# EasyEDA schematic SCH_mgts_main_board_2026-06-15.json
TITLE: Sheet_1; REV: 1.0; Date: 2026-05-31; Sheet: 1/1; Drawn By: u.s.pat1234; Company: Your Company
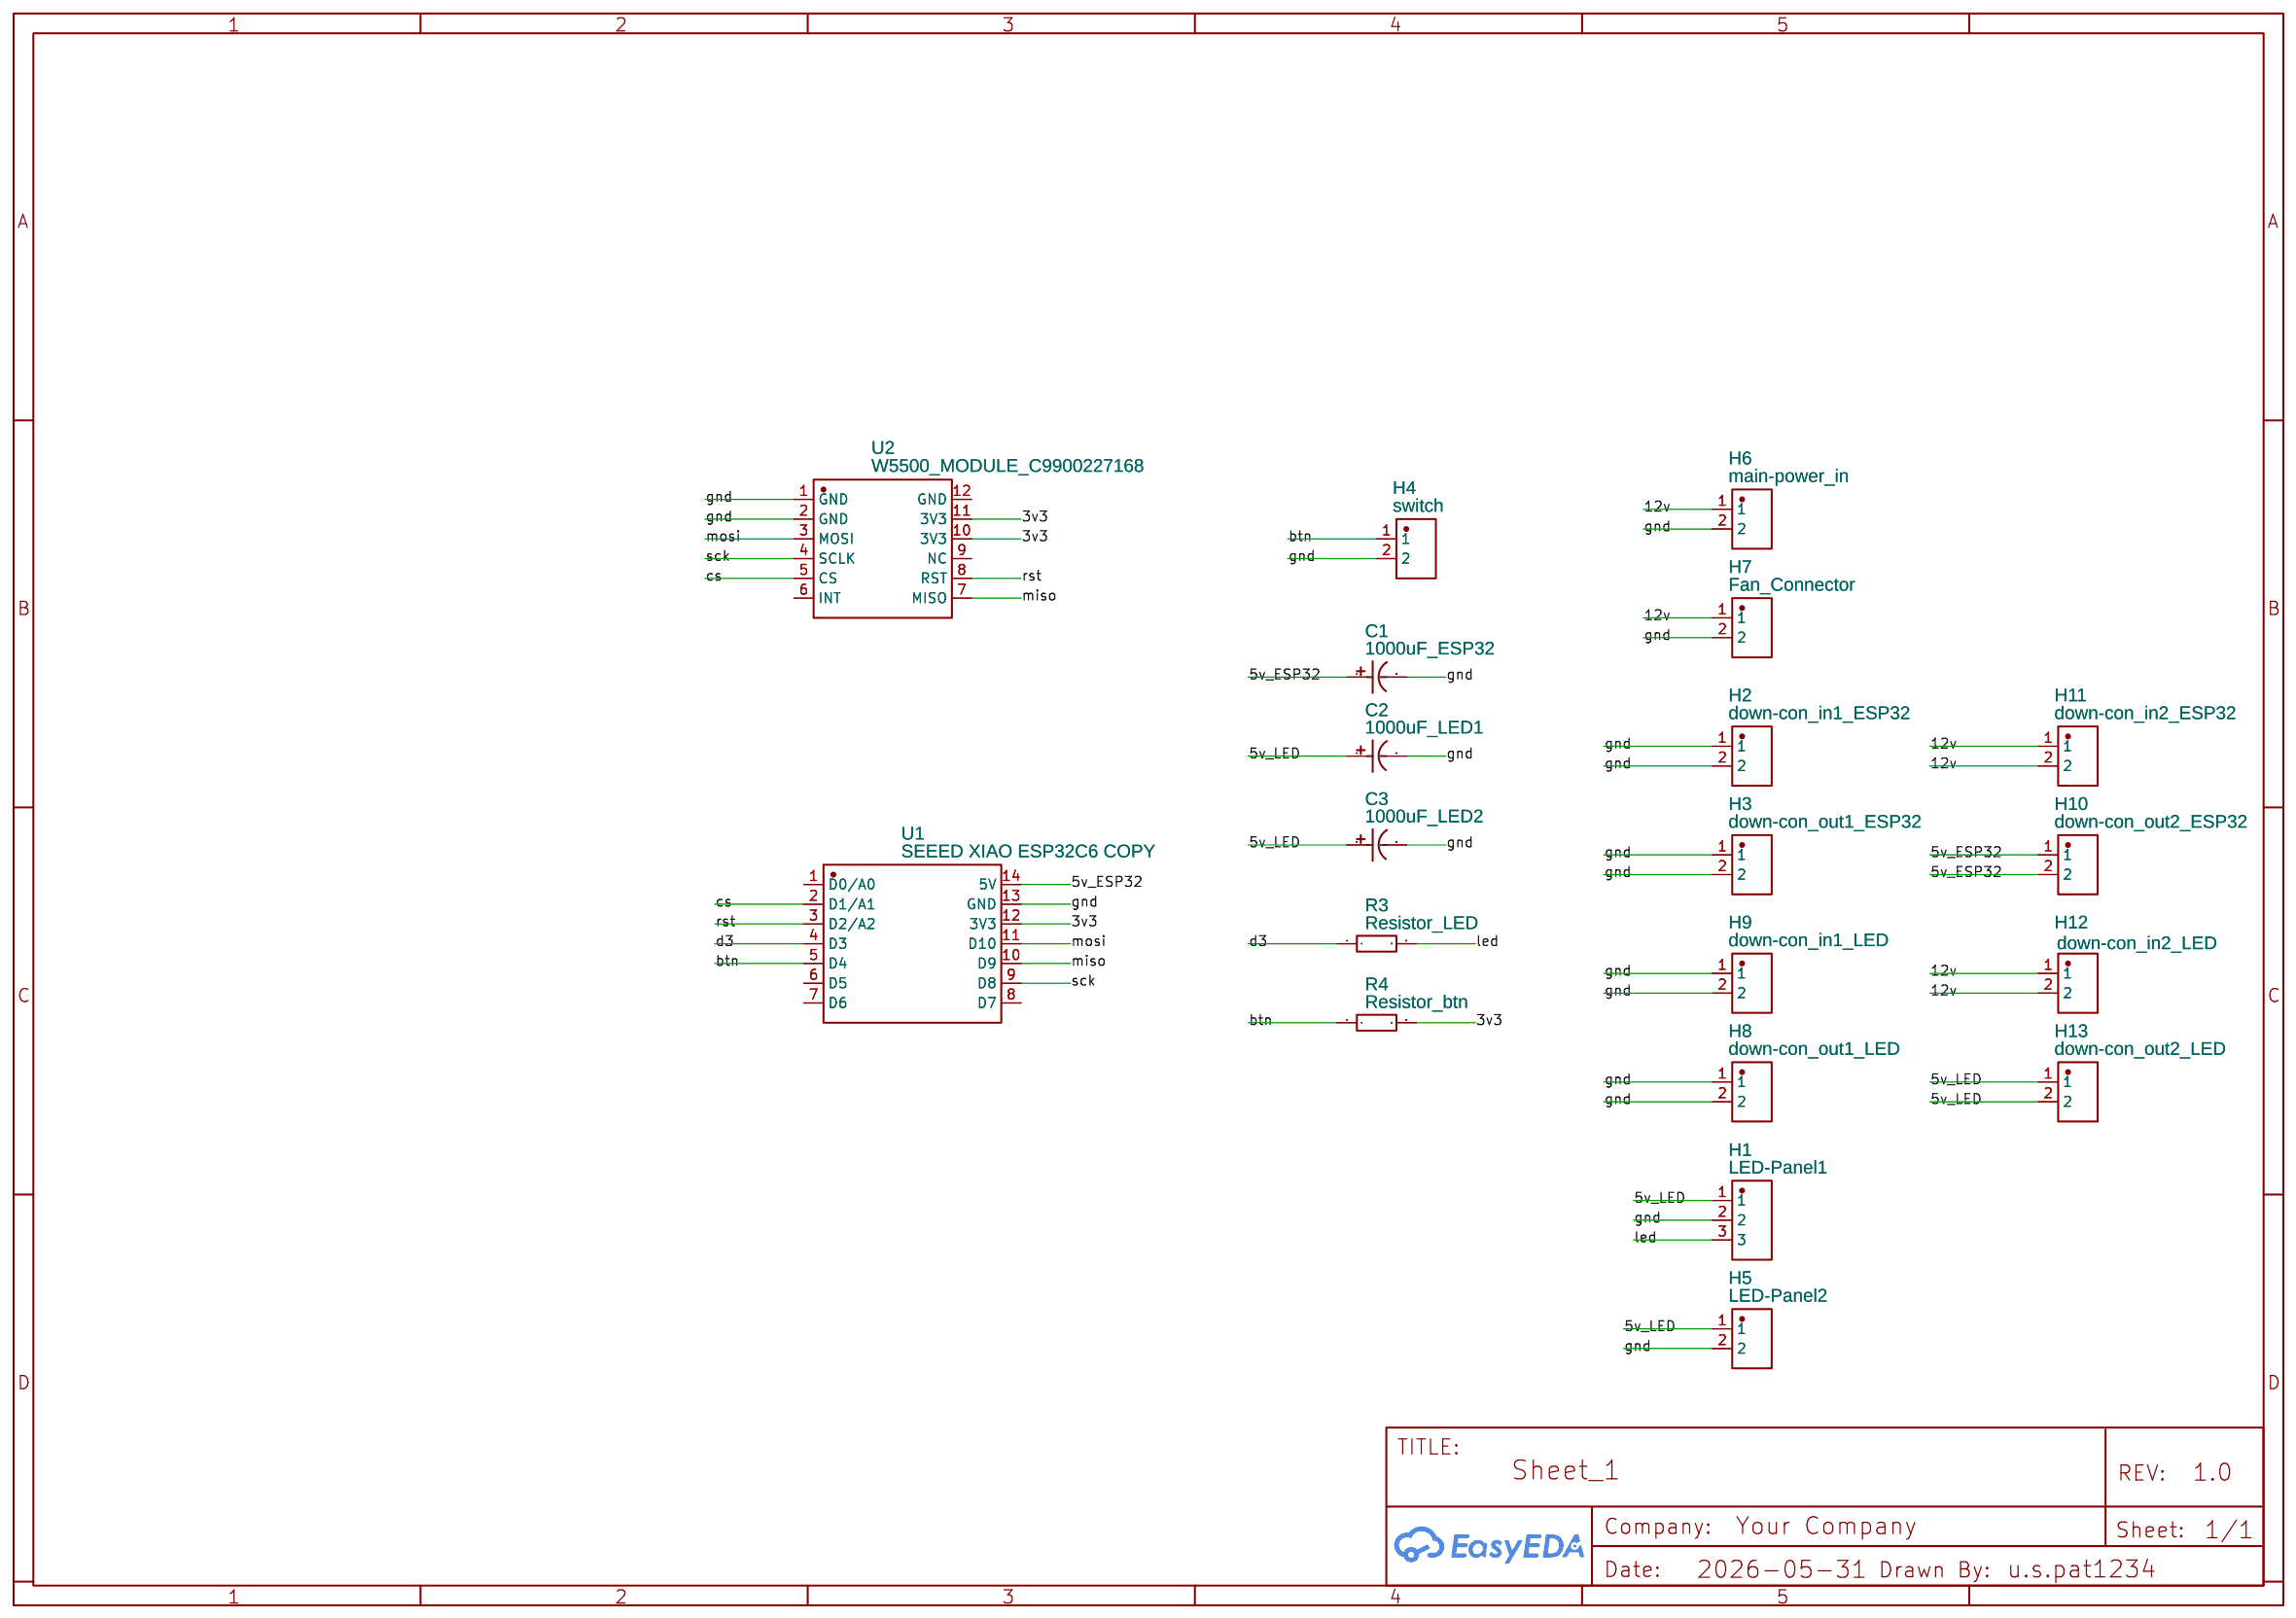
[diagram p0: schematic sheet]

## Parts
C1  1000uF_ESP32  [1000UF 25V ELECTROLYTIC]
C2  1000uF_LED1  [1000UF 25V ELECTROLYTIC]
C3  1000uF_LED2  [1000UF 25V ELECTROLYTIC]
H1  LED-Panel1  [HDR-TH_XY-2.54-1X3PZ]
H2  down-con_in1_ESP32  [HDR-TH_2P-P2.54-H-M_KH-2.54PH90-1X2P-L13.8]
H3  down-con_out1_ESP32  [HDR-TH_2P-P2.54-H-M_KH-2.54PH90-1X2P-L13.8]
H4  switch  [HDR-TH_2P-P2.54-H-M_KH-2.54PH90-1X2P-L13.8]
H5  LED-Panel2  [HDR-TH_2P-P2.54-H-M_KH-2.54PH90-1X2P-L13.8]
H6  main-power_in  [HDR-TH_2P-P2.54-H-M_KH-2.54PH90-1X2P-L13.8]
H7  Fan_Connector  [HDR-TH_2P-P2.54-H-M_KH-2.54PH90-1X2P-L13.8]
H8  down-con_out1_LED  [HDR-TH_2P-P2.54-H-M_KH-2.54PH90-1X2P-L13.8]
H9  down-con_in1_LED  [HDR-TH_2P-P2.54-H-M_KH-2.54PH90-1X2P-L13.8]
H10  down-con_out2_ESP32  [HDR-TH_2P-P2.54-H-M_KH-2.54PH90-1X2P-L13.8]
H11  down-con_in2_ESP32  [HDR-TH_2P-P2.54-H-M_KH-2.54PH90-1X2P-L13.8]
H12  down-con_in2_LED  [HDR-TH_2P-P2.54-H-M_KH-2.54PH90-1X2P-L13.8]
H13  down-con_out2_LED  [HDR-TH_2P-P2.54-H-M_KH-2.54PH90-1X2P-L13.8]
R3  Resistor_LED  [RES-TH_BD3.2-L9.0-P13.00-D0.5]
R4  Resistor_btn  [RES-TH_BD3.2-L9.0-P13.00-D0.5]
U1  SEEED XIAO ESP32C6 COPY  [ESP32C6 XIAO]
U2  W5500_MODULE_C9900227168  [COMM-TH_L25.0-W23.0_W5500_MODULE]

## Library data of the parts
C1-C3 = 1000uF: Contributor: matko123
H1 = XY-2.54-1*3PZ: Supplier: LCSC; Supplier Part: C54110157; Manufacturer: XYECONN(辛译); JLCPCB Part Class: Extended Part; Contributor: lcsc
H2-H13 = KH-2.54PH90-1X2P-L13.8: Contributor: LCSC; Supplier: LCSC; Supplier Part: C2905424; Manufacturer: kinghelm(金航标); JLCPCB Part Class: Extended Part
R3 R4 = 1K-AXIAL-0.4: Contributor: lcsc; Supplier: LCSC; Supplier Part: C9900024064; Manufacturer: null; JLCPCB Part Class: Extended Part
U1 = SEEED XIAO ESP32C6 COPY: Manufacturer: Seeed Studio; Manufacturer Part: XIAO ESP32C6; link: https://wiki.seeedstudio.com/xiao_esp32c6_getting_started/; Contributor: parker4955
U2 = W5500_MODULE_C9900227168: Supplier: LCSC; Supplier Part: C9900227168; Manufacturer: null; Manufacturer Part: W5500_MODULE; JLCPCB Part Class: Extended Part; Contributor: lcsc

## Nets
3v3: R4.2 U1.12(3V3) U2.10(3V3) U2.11(3V3)
5v_ESP32: C1.1 H10.1 H10.2 U1.14(5V)
5v_LED: C2.1 C3.1 H1.1 H5.1 H13.1 H13.2
12v: H6.1 H7.1 H11.1 H11.2 H12.1 H12.2
gnd: C1.2 C2.2 C3.2 H1.2 H2.1 H2.2 H3.1 H3.2 H4.2 H5.2 H6.2 H7.2 H8.1 H8.2 H9.1 H9.2 U1.13(GND) U2.1(GND) U2.2(GND)
btn: H4.1 R4.1 U1.5(D4)
cs: U1.2(D1/A1) U2.5(CS)
d3: R3.1 U1.4(D3)
led: H1.3 R3.2
miso: U1.10(D9) U2.7(MISO)
mosi: U1.11(D10) U2.3(MOSI)
rst: U1.3(D2/A2) U2.8(RST)
sck: U1.9(D8) U2.4(SCLK)

Not connected (* = marked no-connect by the designer): U1 1(D0/A0) 6(D5) 7(D6) 8(D7); U2 6(INT) 9(NC) 12(GND)
